# EAGLE design NJM2670 (EAGLE 7.1.0)
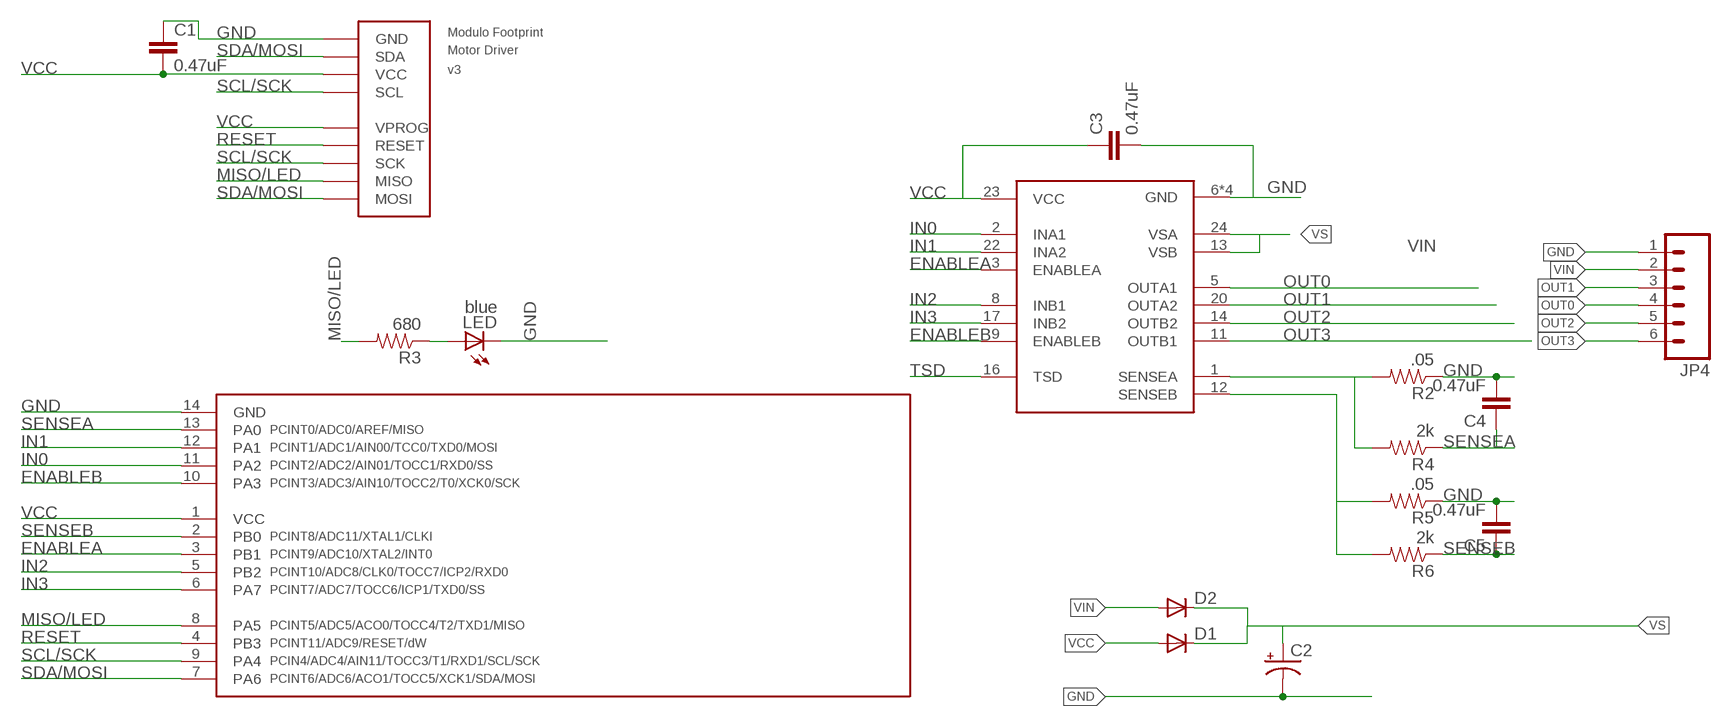
[diagram p0: schematic, sheet 1]

## Parts
C1  0.47uF  CAP0805  [0805]
C2  CAP_POLC  [PANASONIC_C]
C3  0.47uF  CAP0805  [0805]
C4  0.47uF  CAP0805  [0805]
C5  0.47uF  CAP0805  [0805]
D1  DIODESMA  [SMA-DIODE]
D2  DIODESMA  [SMA-DIODE]
JP4  M063.5MM-6  [SCREWTERMINAL-3.5MM-6]
LED  blue  LEDCHIPLED_0805  [CHIPLED_0805]
R2  .05  RESISTOR0805-RES  [0805]
R3  680  RESISTOR0805-RES  [0805]
R4  2k  RESISTOR0805-RES  [0805]
R5  .05  RESISTOR0805-RES  [0805]
R6  2k  RESISTOR0805-RES  [0805]
U$1  FOOTPRINTFOOTPRINT-2  [FOOTPRINT2]
U$3  TINY841  [SOIC14]
U$6  NJM2670  [SOP-24-E3]

## Nets
ENABLEA: U$3.3(PB1) U$6.3(ENABLEA)
ENABLEB: U$3.10(PA3) U$6.9(ENABLEB)
GND: C1.1 C2.- C3.2 C4.2 C5.2 JP4.1 LED.C R2.1 R5.1 U$1.BUS0(GND) U$3.14(GND) U$6.6(GND) U$6.7(GND) U$6.18(GND) U$6.19(GND)
IN0: U$3.11(PA2) U$6.2(INA1)
IN1: U$3.12(PA1) U$6.22(INA2)
IN2: U$3.5(PB2) U$6.8(INB1)
IN3: U$3.6(PA7) U$6.17(INB2)
MISO/LED: R3.2 U$1.PROG3(MISO) U$3.8(PA5)
N$2: R2.2 R4.2 U$6.1(SENSEA)
N$3: R5.2 R6.2 U$6.12(SENSEB)
N$5: LED.A R3.1
OUT0: JP4.4 U$6.5(OUTA1)
OUT1: JP4.3 U$6.20(OUTA2)
OUT2: JP4.5 U$6.14(OUTB2)
OUT3: JP4.6 U$6.11(OUTB1)
RESET: U$1.PROG1(RESET) U$3.4(PB3)
SCL/SCK: U$1.BUS3(SCL) U$1.PROG2(SCK) U$3.9(PA4)
SDA/MOSI: U$1.BUS1(SDA) U$1.PROG4(MOSI) U$3.7(PA6)
SENSEA: C4.1 R4.1 U$3.13(PA0)
SENSEB: C5.1 R6.1 U$3.2(PB0)
TSD: U$6.16(TSD)
VCC: C1.2 C3.1 D1.A U$1.BUS2(VCC) U$1.PROG0(VPROG) U$3.1(VCC) U$6.23(VCC)
VIN: D2.A JP4.2
VS: C2.+ D1.C D2.C U$6.13(VSB) U$6.24(VSA)

## Library data of the parts
C1 C3-C5 = SparkFun-Capacitors:CAP: Capacitor Standard 0603 ceramic capacitor, and 0.1" leaded capacitor.
C2 = SparkFun-Capacitors:CAP_POL: Capacitor Polarized These are standard SMD and PTH capacitors. Normally 10uF, 47uF, and 100uF in electrolytic and tantalum varieties. Always verify the external diameter of the through hole cap, it varies with capacity, voltage, and manufacturer. The EIA devices should be standard.
D1 D2 = SparkFun-DiscreteSemi:DIODE: Diode These are standard reverse protection diodes and small signal diodes. SMA package can handle up to about 1A. SOD-323 can handle about 200mA. What the SOD-323 package when ordering, there are some mfgs out there that are 5-pin packages.
JP4 = SparkFun-Connectors:M06: Header 6 Standard 6-pin 0.1" header. Use with straight break away headers (SKU : PRT-00116), right angle break away headers (PRT-00553), swiss pins (PRT-00743), machine pins (PRT-00117), and female headers (PRT-00115). Molex polarized connector foot print use with SKU : PRT-08094 with associated crimp pins and housings. NOTES ON THE VARIANTS LOCK and LOCK_LONGPADS... This footprint was designed to help hold the alignment of a through-hole component (i.e. 6-pin header) while soldering it into place. You may notice that each hole has been shifted either up or down by 0.005 of an inch from it's more standard position (which is a perfectly straight line). This slight alteration caused the pins (the squares in the middle) to touch the edges of the holes. Because they are alternating, it causes a "brace" to hold the component in place. 0.005 has proven to be the perfect amount of "off-center" position when using our standard breakaway headers. Although looks a little odd when you look at the bare footprint, once you have a header in there, the alteration is very hard to notice. Also,if you push a header all the way into place, it is covered up entirely on the bottom side. This idea of altering the position of holes to aid alignment will be further integrated into the Sparkfun Library for other footprints. It can help hold any component with 3 or more connection pins.
LED = adafruit:LED: LED OSRAM: - CHIPLED LG R971, LG N971, LY N971, LG Q971, LY Q971, LO R971, LY R971 LH N974, LH R974 LS Q976, LO Q976, LY Q976 LO Q996 - Hyper CHIPLED LW Q18S LB Q993, LB Q99A, LB R99A - SideLED LS A670, LO A670, LY A670, LG A670, LP A670 LB A673, LV A673, LT A673, LW A673 LH A674 LY A675 LS A676, LA A676, LO A676, LY A676, LW A676 LS A679, LY A679, LG A679 - Hyper Micro SIDELED® LS Y876, LA Y876, LO Y876, LY Y876 LT Y87S - SmartLED LW L88C, LW L88S LB L89C, LB L89S, LG L890 LS L89K, LO L89K, LY L89K LS L896, LA L896, LO L896, LY L896 - TOPLED LS T670, LO T670, LY T670, LG T670, LP T670 LSG T670, LSP T670, LSY T670, LOP T670, LYG T670 LG T671, LOG T671, LSG T671 LB T673, LV T673, LT T673, LW T673 LH T674 LS T676, LA T676, LO T676, LY T676, LB T676, LH T676, LSB T676, LW T676 LB T67C, LV T67C, LT T67C, LS T67K, LO T67K, LY T67K, LW E67C LS E67B, LA E67B, LO E67B, LY E67B, LB E67C, LV E67C, LT E67C LW T67C LS T679, LY T679, LG T679 LS T770, LO T770, LY T770, LG T770, LP T770 LB T773, LV T773, LT T773, LW T773 LH T774 LS E675, LA E675, LY E675, LS T675 LS T776, LA T776, LO T776, LY T776, LB T776 LHGB T686 LT T68C, LB T68C - Hyper Mini TOPLED® LB M676 - Mini TOPLED Santana® LG M470 LS M47K, LO M47K, LY M47K Source: http://www.osram.convergy.de/
R2-R6 = SparkFun-Passives:RESISTOR: Resistor Basic schematic elements and footprints for 0603, 1206, and PTH resistors.
U$1 = IntegerLabs:FOOTPRINT: Modulo Footprint; BOARD: Motor Driver; VERSION: v3
U$3 = IntegerLabs:TINY841
U$6 = IntegerLabs:NJM2670

## Board
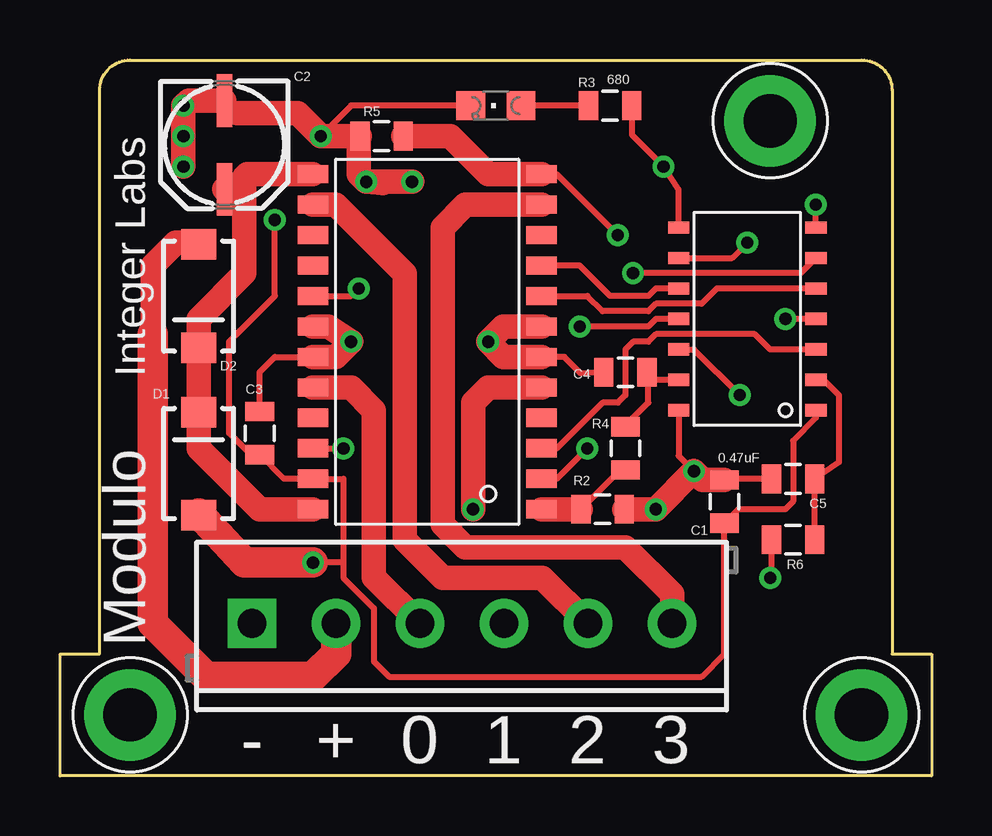
[diagram p1: board, top side]
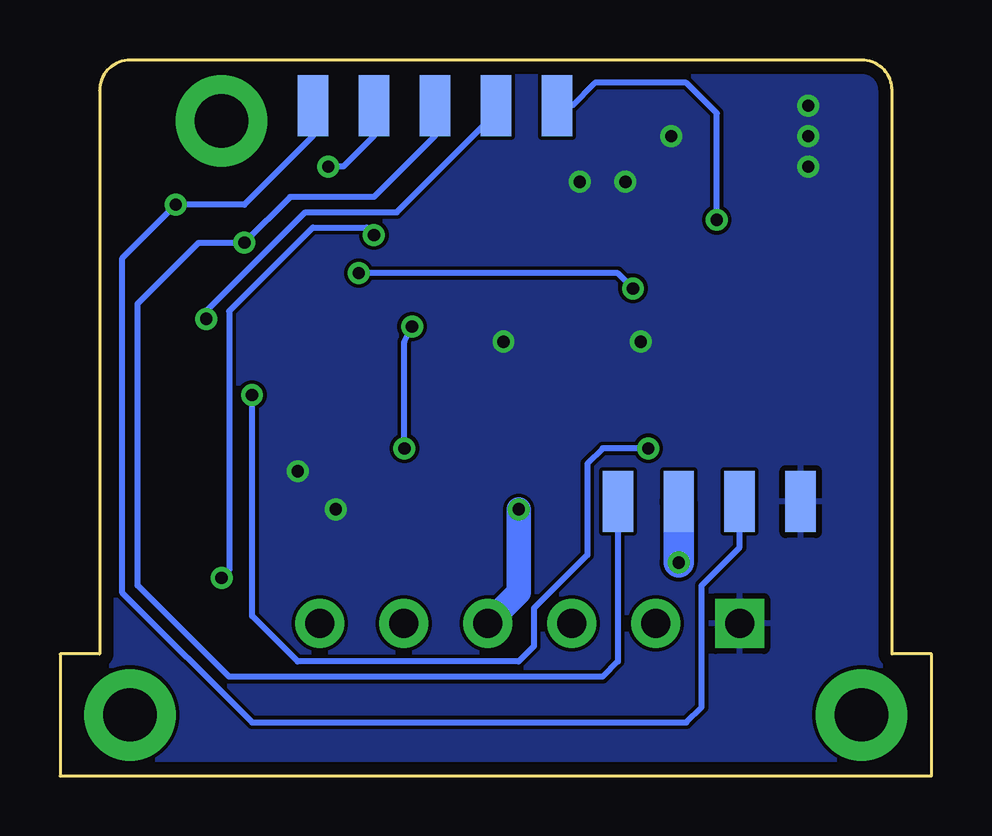
[diagram p2: board, bottom side, seen from below]

Size 36.32 x 29.84 mm. Coordinates in mm from the lower left corner, seen from the top.
Copper layers (1*16): Top 0.0178mm / dielectric 59mil / Bottom 0.0178mm
Design rules "SSC-EAGLE-2Lyr_v1.0.0.3": minimum track width 6mil, minimum drill 14mil, track to track 6mil, track to pad 6mil, pad to pad 6mil, via to via 6mil, smd to smd 6mil, copper to edge 20mil, drill to drill 16mil, minimum pad ring 8mil, minimum via ring 8mil, stop-mask expansion 3mil, vias tented up to drill 0mil, thermal gap 10mil

### Footprints (pad centres in the part's own frame; a part is rotated, then mirrored left to right if it is on the bottom)
0805 = smd 0.8 x 1.2: 1 -0.9,0; 2 0.9,0
PANASONIC_C = smd 2.2 x 0.65: + 1.9,-0.2; - -1.8,-0.2
SMA-DIODE = smd 1.27 x 1.47: A -2.15,0; C 2.15,0
SCREWTERMINAL-3.5MM-6 = drill 1.2 pad 2.032 square: 1 0,0 | drill 1.2 pad 2.032: 2 3.5,0; 3 7,0; 4 10.5,0; 5 14,0; 6 17.5,0
CHIPLED_0805 = smd 1.2 x 1.2: A 0,-1.05; C 0,1.05
FOOTPRINT2 = smd 1.27 x 2.54 bottom: BUS0 5.08,11.43; BUS1 7.62,11.43; BUS2 10.16,11.43; BUS3 12.7,11.43; PROG0 15.24,27.94; PROG1 17.78,27.94; PROG2 20.32,27.94; PROG3 22.86,27.94; PROG4 25.4,27.94 | drill 2.223 pad 3.81: P$1 2.54,2.54; P$2 33.02,2.54; P$3 29.21,27.305
SOIC14 = smd 0.508 x 0.889: 1 0,-3.175; 2 1.27,-3.175; 3 2.54,-3.175; 4 3.81,-3.175; 5 5.08,-3.175; 6 6.35,-3.175; 7 7.62,-3.175; 8 7.62,2.54; 9 6.35,2.54; 10 5.08,2.54; 11 3.81,2.54; 12 2.54,2.54; 13 1.27,2.54; 14 0,2.54
SOP-24-E3 = smd 0.762 x 1.27: 1 -6.35,-4.445; 2 -5.08,-4.445; 3 -3.81,-4.445; 4 -2.54,-4.445; 5 -1.27,-4.445; 6 0,-4.445; 7 1.27,-4.445; 8 2.54,-4.445; 9 3.81,-4.445; 10 5.08,-4.445; 11 6.35,-4.445; 12 7.62,-4.445; 13 7.62,5.08; 14 6.35,5.08; 15 5.08,5.08; 16 3.81,5.08; 17 2.54,5.08; 18 1.27,5.08; 19 0,5.08; 20 -1.27,5.08; 21 -2.54,5.08; 22 -3.81,5.08; 23 -5.08,5.08; 24 -6.35,5.08

### Placement (x,y rotation side)
C1  27.69,11.43 270 top
C2  7.05,26.35 270 top
C3  8.32,14.29 90 top
C4  23.56,16.83 180 top
C5  30.54,12.38 180 top
D1  5.78,13.02 90 top
D2  5.78,20 270 top
JP4  8,6.35 0 top
LED  18.16,27.94 90 top
R2  22.61,11.11 180 top
R3  22.92,27.94 0 top
R4  23.56,13.65 270 top
R5  13.4,26.67 0 top
R6  30.54,9.84 180 top
U$1  0.38,0 0 top
U$3  28.32,15.24 90 top
U$6  15.62,17.46 90 top

### Tracks (layer width: path | path; a pad name or v marks a point on that pad's centre or on a via)
ENABLEA
  Top 0.254: U$3.3 29.59,17.78 28.96,18.41 24.83,18.41 24.51,18.1 23.88,18.1 23.56,17.78 23.56,15.88 23.24,15.56 22.61,15.56 20.7,13.65 U$6.3
ENABLEB
  Top 0.254: U$3.10 24.83,20.32 24.51,20 22.92,20 21.65,21.27 U$6.9
GND  (via drill 0.51)
  Top 0.254: LED.C 12.13,27.94 v10.86,26.67 | U$6.7 20.38,18.73 | C3.2 8.32,16.83 8.95,17.46 U$6.19 | C4.2 21.71,16.77 21.02,17.46 U$6.6 | C5.2 27.74,12.38 C1.1 | U$3.14 25.78,13.34 v26.42,12.7
  Top 1.016: R2.1 v24.83,11.11 v26.42,12.7 26.79,12.33 C1.1 | U$6.19 11.49,17.46 v12.13,18.1 11.18,18.73 U$6.18 | U$6.7 18.48,18.73 v17.84,18.1 18.48,17.46 U$6.6 | 7.38,27.62 9.91,27.62 v10.86,26.67 12.45,26.67 | 13.45,24.71 v12.76,24.77 | v12.76,24.77 12.45,25.08 12.45,26.67 | v12.76,24.77 v14.67,24.77 | C2.- 5.36,28.15 v5.14,27.94 v5.14,26.67 v5.14,25.4 | R5.1 12.45,26.67
  pour Bottom: -0.89,0 -0.89,30.48 37.21,30.48 37.21,0
IN0  (via drill 0.51)
  Top 0.254: U$6.2 20.7,12.38 v21.97,13.65 | U$3.11 24.83,19.05 24.51,18.73 v21.65,18.73
  Bottom 0.254: v21.97,13.65 21.97,18.1 v21.65,18.73
IN1  (via drill 0.51)
  Top 0.254: U$6.22 v11.81,13.65 | U$3.12 26.42,17.78 v28.32,15.88
  Bottom 0.254: v11.81,13.65 13.72,13.65 14.35,13.02 14.35,9.21 16.57,6.99 16.57,5.4 17.21,4.76 26.42,4.76 28.32,6.67 v28.32,15.88
IN2
  Top 0.254: U$6.8 21.97,20 22.61,19.37 24.51,19.37 24.83,19.68 26.73,19.68 27.37,20.32 U$3.5
IN3  (via drill 0.51)
  Top 0.254: U$6.17 12.13,20 v12.45,20.32 | U$3.6 30.86,20.95 v23.88,20.95
  Bottom 0.254: v12.45,20.32 13.08,20.95 v23.88,20.95
MISO/LED  (via drill 0.51)
  Top 0.254: R3.2 23.82,26.72 v25.15,25.4 25.78,24.45 U$3.8
  Bottom 0.254: U$1.PROG3 23.24,26.67 24.51,25.4 v25.15,25.4
N$2
  Top 0.254: R4.2 23.56,12.7 23.29,12.65 23.29,12.7 R2.2
  Top 1.016: U$6.1 R2.2
N$3  (via drill 0.51)
  Top 0.254: U$6.12 20.7,25.08 v23.24,22.54 | R6.2 29.64,8.31 v29.59,8.26
  Top 1.016: U$6.12 17.84,25.08 16.26,26.67 R5.2
  Bottom 0.254: v23.24,22.54 23.56,22.86 25.78,22.86 29.27,19.37 29.27,8.57 v29.59,8.26
N$5
  Top 0.254: R3.1 LED.A
OUT0  (via drill 0.51)
  Top 1.016: U$6.5 17.84,16.19 17.21,15.56 v17.21,11.11
  Bottom 1.016: v17.21,11.11 17.21,7.64 JP4.4
OUT1
  Top 1.016: U$6.20 12.13,16.19 13.08,15.24 13.08,8.27 JP4.3
OUT2
  Top 1.016: U$6.14 11.49,23.81 14.37,20.94 14.37,9.83 15.94,8.26 20.1,8.26 JP4.5
OUT3
  Top 1.016: U$6.11 16.89,23.81 15.94,22.86 15.94,10.48 16.89,9.53 23.56,9.53 25.5,7.58 JP4.6
RESET  (via drill 0.51)
  Top 0.254: U$3.4 31.18,19.05 v30.23,19.05
  Bottom 0.254: U$1.PROG1 18.16,27.62 22.29,23.5 26.1,23.5 30.23,19.37 v30.23,19.05
SCL/SCK  (via drill 0.51)
  Top 0.254: U$3.9 28,21.59 v28.64,22.23
  Bottom 0.254: U$1.PROG2 20.7,26.67 23.24,24.13 26.73,24.13 v28.64,22.23 30.54,22.23 33.08,19.68 33.08,7.94 29.27,4.13 13.72,4.13 13.08,4.76 U$1.BUS3 | U$1.BUS3 13.08,11.11 | U$1.BUS3 13.08,11.75
SDA/MOSI  (via drill 0.51)
  Top 0.254: U$3.7 v31.5,23.81
  Bottom 0.254: U$1.PROG4 25.78,26.67 28.64,23.81 v31.5,23.81 33.72,21.59 33.72,7.62 28.32,2.22 10.22,2.22 9.59,2.86 9.59,7.94 8,9.53 U$1.BUS1
SENSEA
  Top 0.254: R4.1 23.56,14.61 24.51,15.56 24.51,16.77 C4.1 24.78,16.51 U$3.13
SENSEB
  Top 0.254: R6.1 C5.1 32.45,13.07 32.45,15.88 31.81,16.51 U$3.2
VCC  (via drill 0.51)
  Top 0.254: 11.81,8.89 11.81,12.38 U$6.23 9.32,12.38 C3.1 7.95,13.39 7.05,14.29 7.05,18.1 8.95,20 v8.95,23.18 | 11.81,8.89 v10.54,8.89 | 11.81,8.89 11.81,8.26 13.08,6.99 13.08,4.76 13.72,4.13 26.73,4.13 27.69,5.08 C1.2 28.27,11.11 30.23,11.11 30.54,11.43 30.54,13.97 31.5,14.92 U$3.1
  Top 1.016: 5.78,10.94 5.85,10.94 D1.A
  Top 1.27: v10.54,8.89 7.68,8.89 5.78,10.94
  Bottom 0.254: v8.95,23.18 8.95,27.62 10.22,28.89 14.03,28.89 14.99,27.94 U$1.PROG0
  Bottom 1.27: U$1.BUS2 v10.54,8.89
VIN
  Top 1.016: 3.87,18.41 3.87,21.27 4.83,22.23 5.71,22.23 D2.A
  Top 1.27: JP4.2 11.5,5.09 10.54,4.13 6.1,4.13 3.87,6.35 3.87,18.41
VS
  Top 1.016: U$6.24 8.32,11.11 5.78,13.65 D1.C D2.C 5.78,19.05 7.68,20.95 7.68,24.45 | 7.68,24.45 7.68,24.97 7.8,25.08 U$6.13 | C2.+ 7.68,24.45

### Text on the board
tNames: - | + | 0 | 1 | 2 | 3